# Altium schematic sheet 01_INDEX.SchDoc
size 420 x 297 mm; SheetNumber: 1; SheetTotal: 22
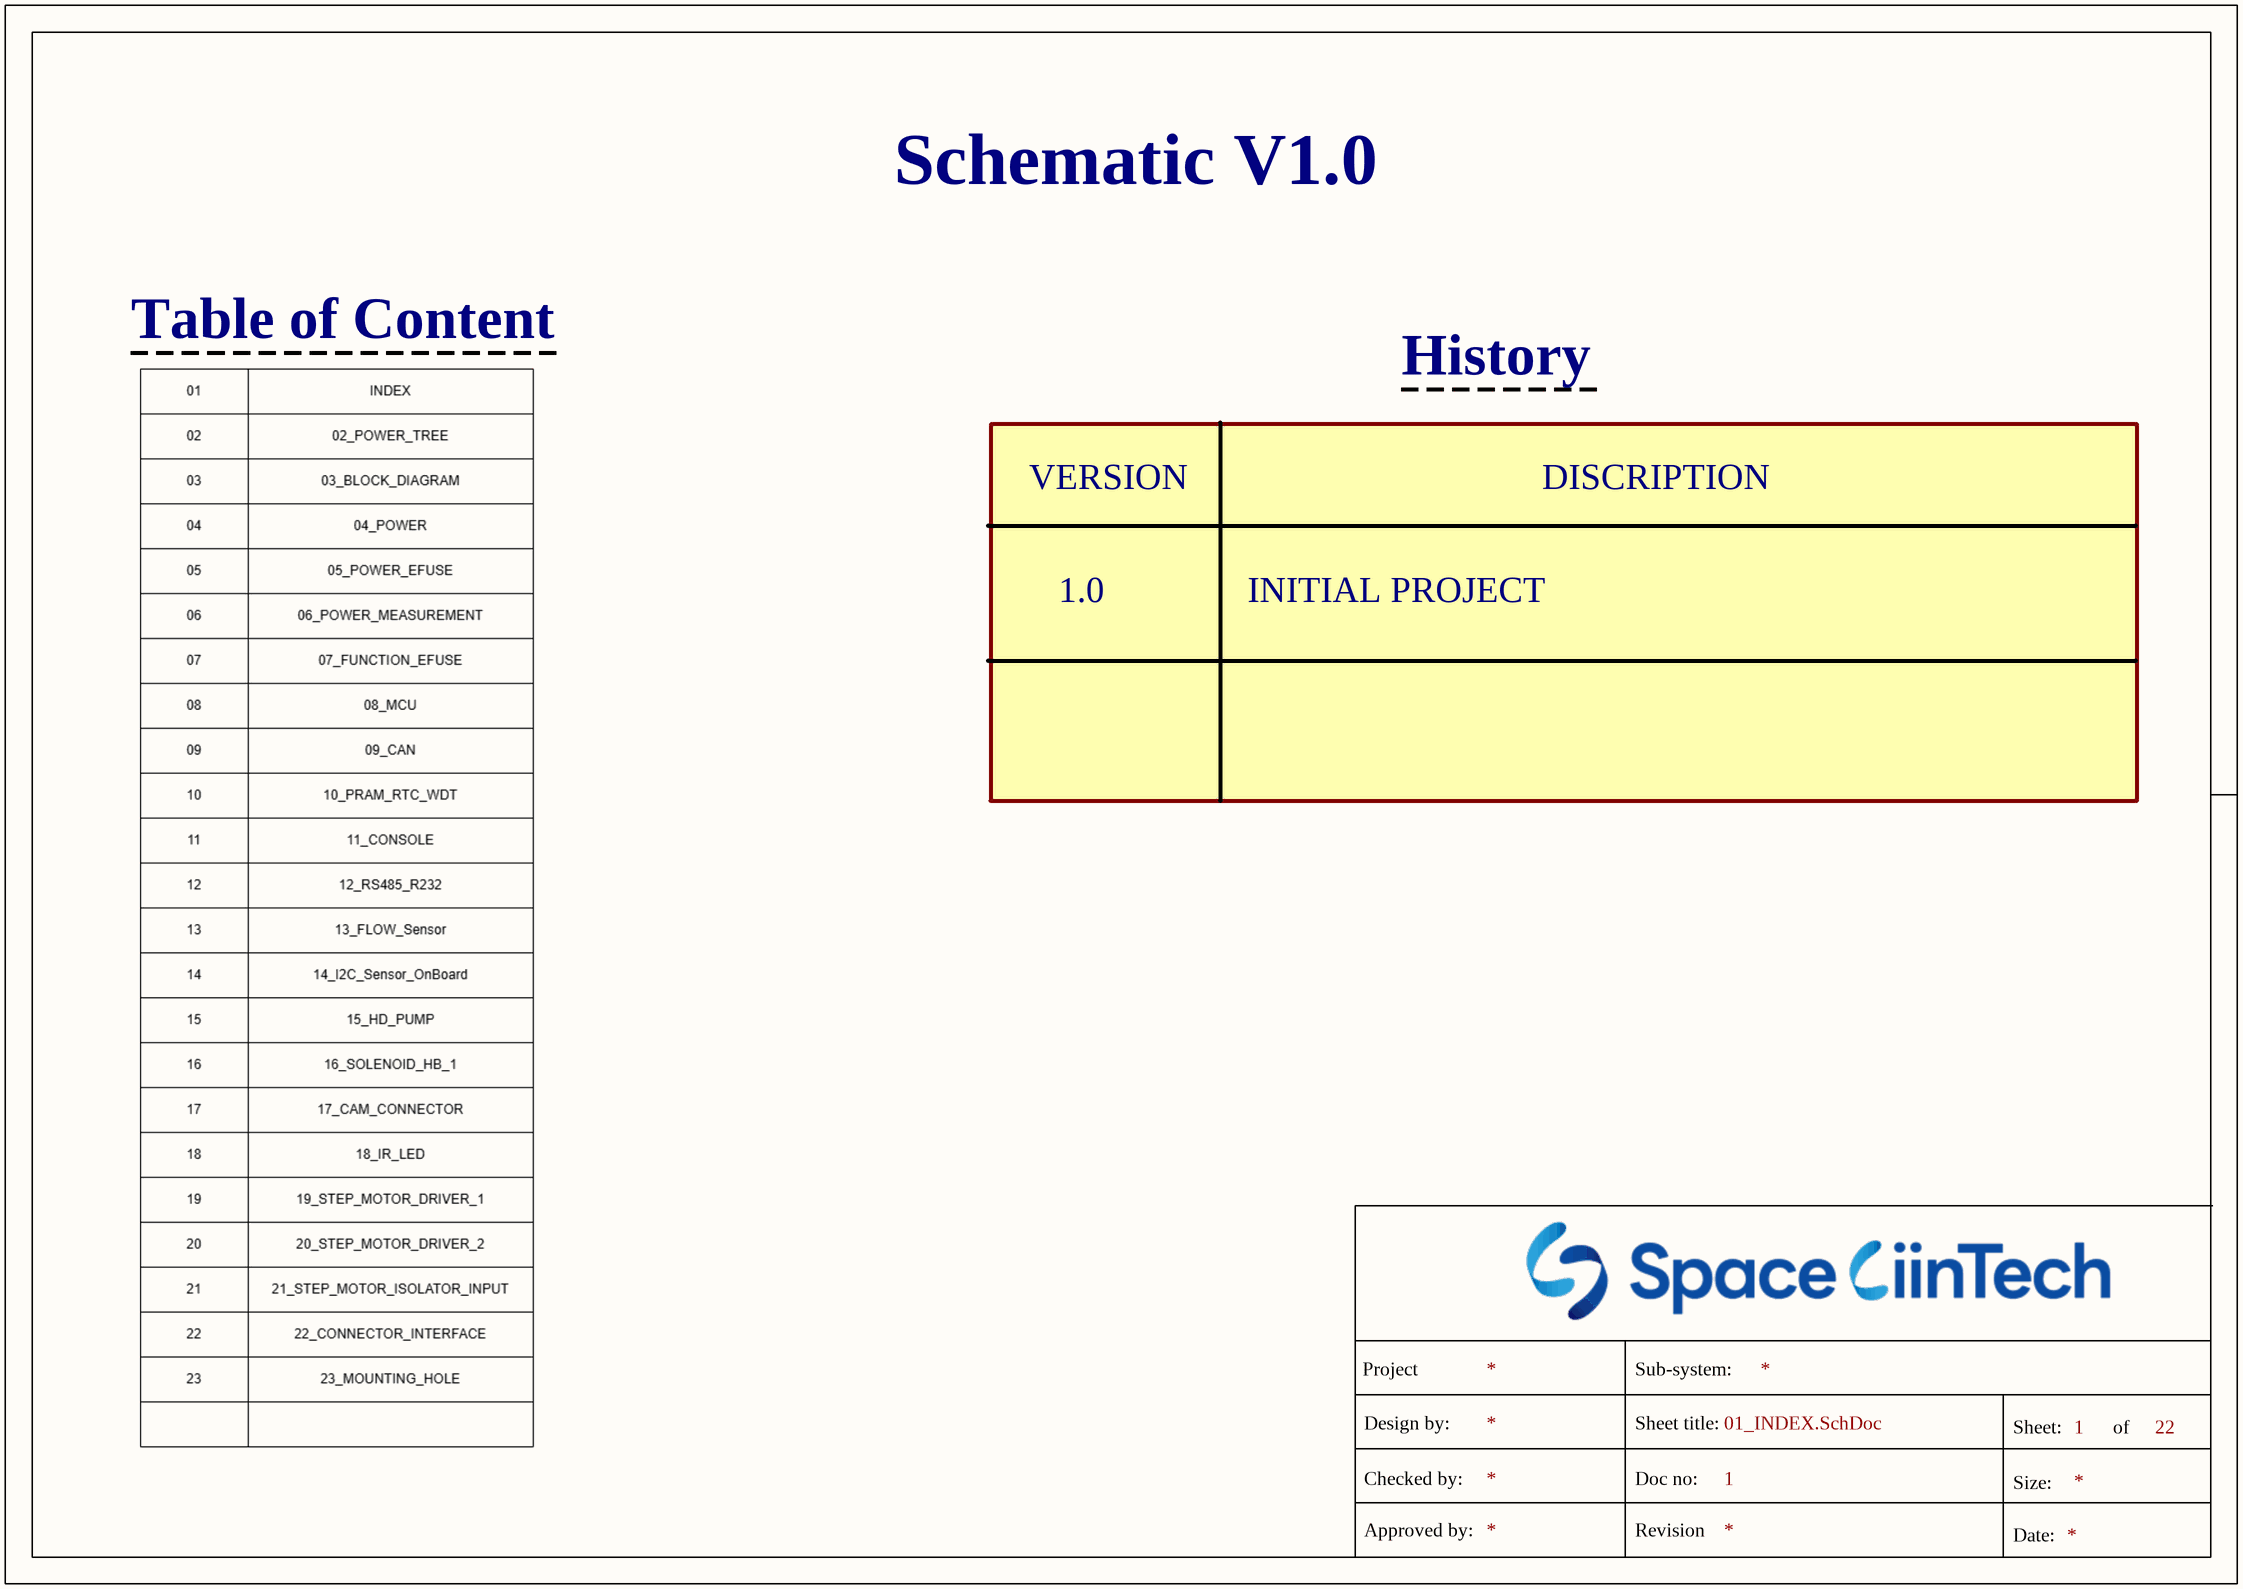
[diagram p0: 01_INDEX.SchDoc]

## Notes on the sheet
- Schematic V1.0
- Table of Content
- History
- VERSION
- DISCRIPTION
- 1.0
- INITIAL PROJECT
- Project
- Sub-system:
- Design by:
- Sheet title:
- Sheet:
- of
- Checked by:
- Approved by:
- Doc no:
- Revision
- Size:
- Date: